# EAGLE design BrainFuino (EAGLE 9.6.0)
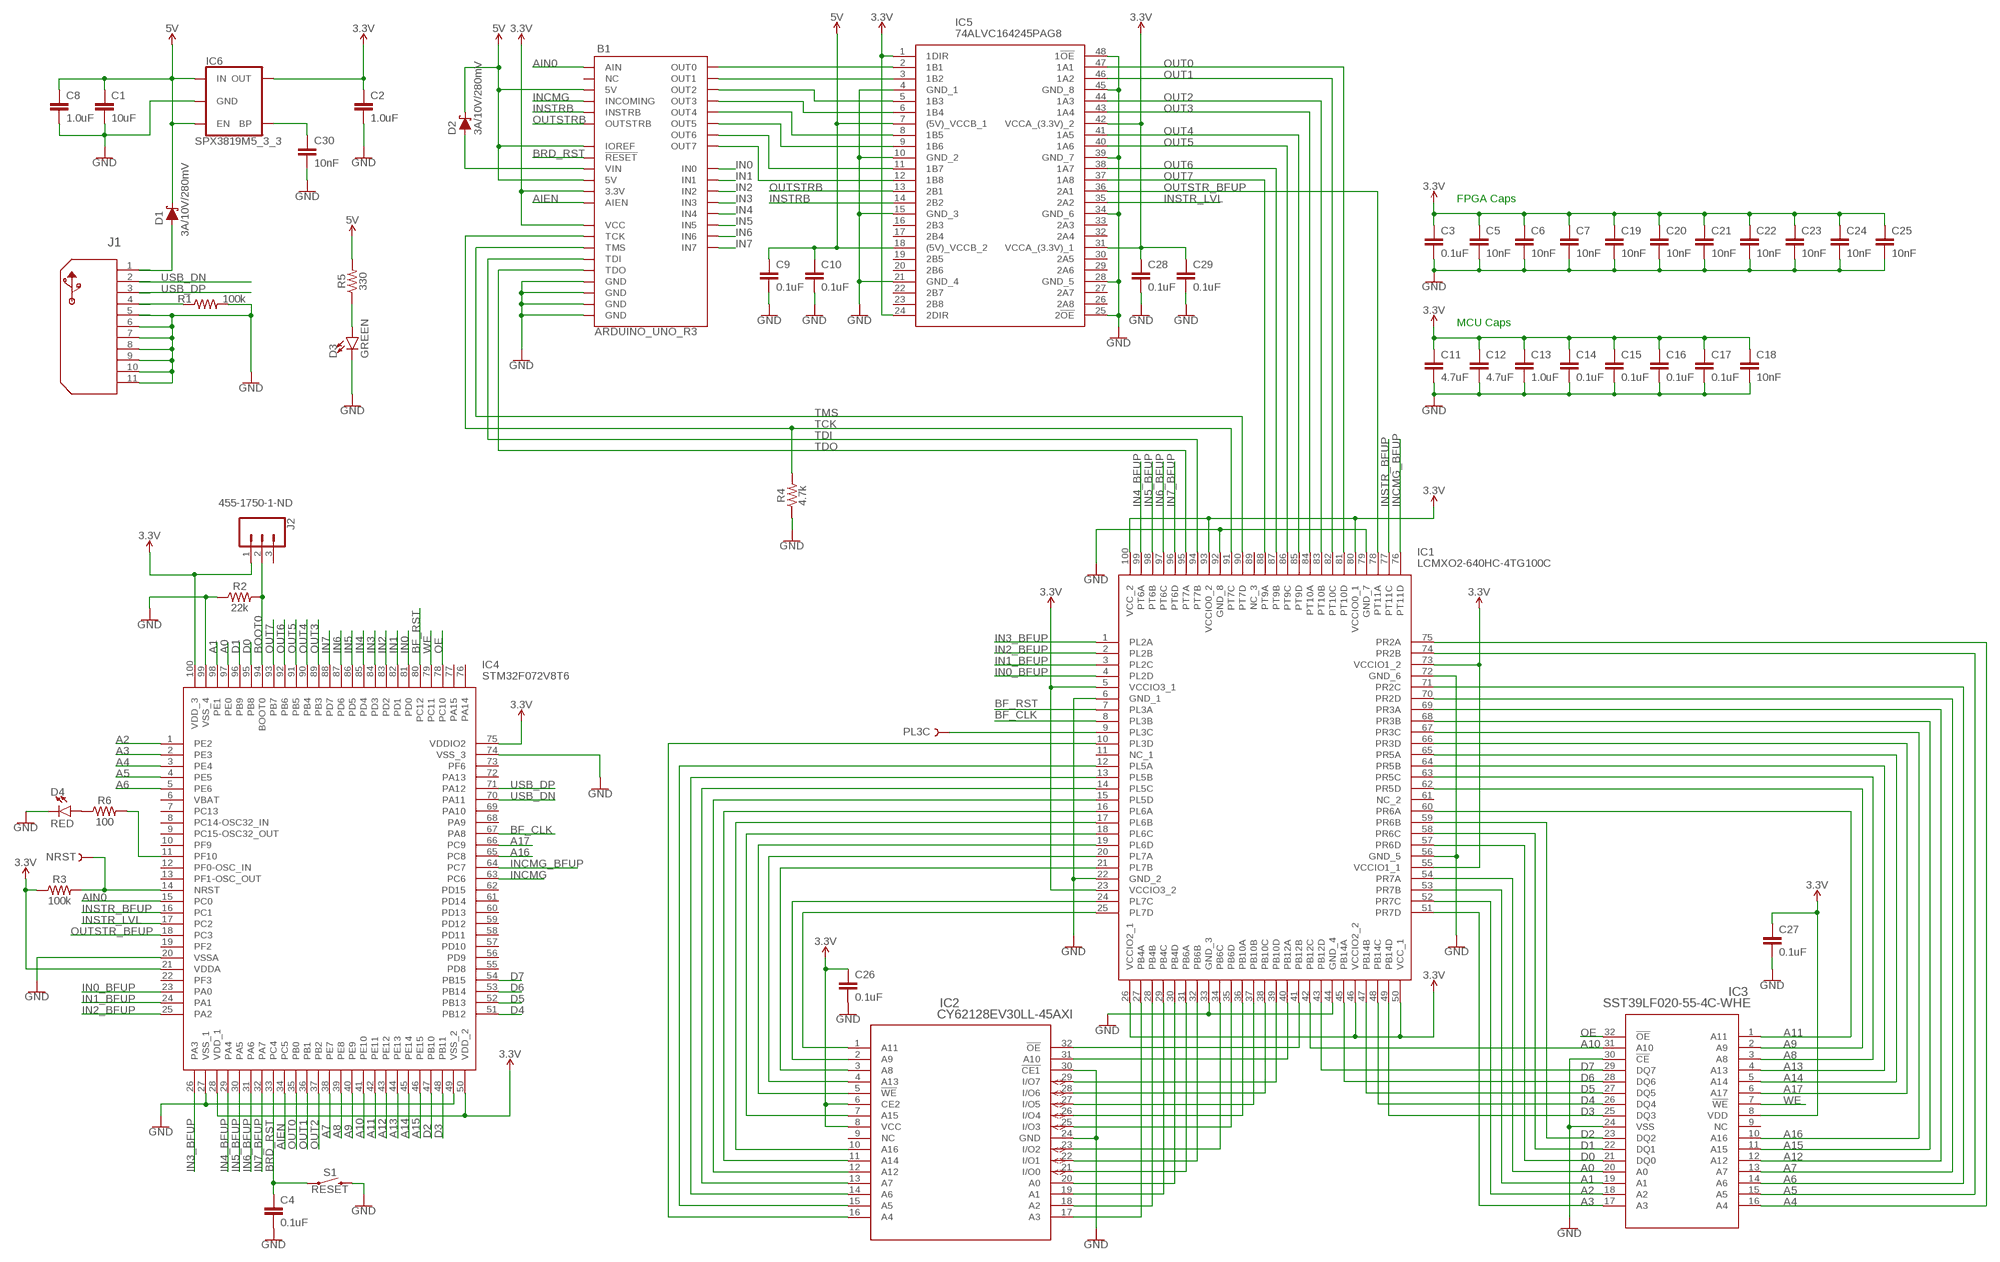
[diagram p0: schematic, sheet 1]

## Parts
B1  ARDUINO_UNO_R3  [ARDUINO_R3]
C1  10uF  10UF-0603-6.3V-20%  [0603]
C2  1.0uF  1.0UF-0603-16V-10%-X7R  [0603]
C3  0.1uF  0.1UF-0603-25V-5%  [0603]
C4  0.1uF  0.1UF-0603-25V-5%  [0603]
C5  10nF  10NF-0603-50V-10%  [0603]
C6  10nF  10NF-0603-50V-10%  [0603]
C7  10nF  10NF-0603-50V-10%  [0603]
C8  1.0uF  1.0UF-0603-16V-10%-X7R  [0603]
C9  0.1uF  0.1UF-0603-25V-5%  [0603]
C10  0.1uF  0.1UF-0603-25V-5%  [0603]
C11  4.7uF  4.7UF-0603-6.3V-(10%)  [0603]
C12  4.7uF  4.7UF-0603-6.3V-(10%)  [0603]
C13  1.0uF  1.0UF-0603-16V-10%  [0603]
C14  0.1uF  0.1UF-0603-25V-5%  [0603]
C15  0.1uF  0.1UF-0603-25V-5%  [0603]
C16  0.1uF  0.1UF-0603-25V-5%  [0603]
C17  0.1uF  0.1UF-0603-25V-5%  [0603]
C18  10nF  10NF-0603-50V-10%  [0603]
C19  10nF  10NF-0603-50V-10%  [0603]
C20  10nF  10NF-0603-50V-10%  [0603]
C21  10nF  10NF-0603-50V-10%  [0603]
C22  10nF  10NF-0603-50V-10%  [0603]
C23  10nF  10NF-0603-50V-10%  [0603]
C24  10nF  10NF-0603-50V-10%  [0603]
C25  10nF  10NF-0603-50V-10%  [0603]
C26  0.1uF  0.1UF-0603-25V-5%  [0603]
C27  0.1uF  0.1UF-0603-25V-5%  [0603]
C28  0.1uF  0.1UF-0603-25V-5%  [0603]
C29  0.1uF  0.1UF-0603-25V-5%  [0603]
C30  10nF  10NF-0603-50V-10%  [0603]
D1  3A/10V/280mV  DIODE-SCHOTTKY-BAT60A  [SOD-323]
D2  3A/10V/280mV  DIODE-SCHOTTKY-BAT60A  [SOD-323]
D3  GREEN  LED-GREEN0603  [LED-0603]
D4  RED  LED-RED0603  [LED-0603]
IC1  LCMXO2-640HC-4TG100C  [QFP50P1600X1600X160-100N]
IC2  CY62128EV30LL-45AXI  [TSOP-32]
IC3  SST39LF020-55-4C-WHE  [TSOP32_WH_SST]
IC4  STM32F072V8T6  [QFP50P1600X1600X160-100N]
IC5  74ALVC164245PAG8  [SOP50P810X120-48N]
IC6  SPX3819M5_3_3  V_REG_SPX3819-SOT23-5  [SOT23-5]
J1  1981568-1  [CONN5_1981568-1_TEC]
J2  455-1750-1-ND  CONN_03  [1X03]
NRST  TEST-POINTPOGO_PTH  [1X01_NO_SILK]
PL3C  TEST-POINTPOGO_PTH  [1X01_NO_SILK]
R1  100k  100KOHM-0603-1/10W-1%  [0603]
R2  22k  22KOHM-0603-1/10W-1%  [0603]
R3  100k  100KOHM-0603-1/10W-1%  [0603]
R4  4.7k  4.7KOHM-0603-1/10W-1%  [0603]
R5  330  330OHM-0603-1/10W-1%  [0603]
R6  100  100OHM-0603-1/10W-1%  [0603]
S1  RESET  MOMENTARY-SWITCH-SPST-SMD-6.2MM-TALL  [TACTILE_SWITCH_SMD_6.2MM_TALL]

## Nets
3.3V: B1.3.3V B1.VCC C2.1 C3.1 C5.1 C6.1 C7.1 C11.1 C12.1 C13.1 C14.1 C15.1 C16.1 C17.1 C18.1 C19.1 C20.1 C21.1 C22.1 C23.1 C24.1 C25.1 C26.1 C27.1 C28.1 C29.1 IC1.5(VCCIO3_1) IC1.23(VCCIO3_2) IC1.26(VCCIO2_1) IC1.46(VCCIO2_2) IC1.50(VCC_1) IC1.55(VCCIO1_1) IC1.73(VCCIO1_2) IC1.80(VCCIO0_1) IC1.93(VCCIO0_2) IC1.100(VCC_2) IC2.6(CE2) IC2.8(VCC) IC3.8(VDD) IC4.21(VDDA) IC4.28(VDD_1) IC4.50(VDD_2) IC4.75(VDDIO2) IC4.100(VDD_3) IC5.1(1DIR) IC5.24(2DIR) IC5.31(VCCA_(3.3V)_1) IC5.42(VCCA_(3.3V)_2) IC6.5(OUT) J2.1 R3.1
5V: B1.5V B1.5V@1(5V) B1.IOREF C1.1 C8.1 C9.1 C10.1 D1.C D2.C IC5.7((5V)_VCCB_1) IC5.18((5V)_VCCB_2) IC6.1(IN) IC6.3(EN) R5.2
A0: IC1.54(PR7A) IC3.20(A0) IC4.97(PE0)
A1: IC1.53(PR7B) IC3.19(A1) IC4.98(PE1)
A2: IC1.52(PR7C) IC3.18(A2) IC4.1(PE2)
A3: IC1.51(PR7D) IC3.17(A3) IC4.2(PE3)
A4: IC1.75(PR2A) IC3.16(A4) IC4.3(PE4)
A5: IC1.74(PR2B) IC3.15(A5) IC4.4(PE5)
A6: IC1.71(PR2C) IC3.14(A6) IC4.5(PE6)
A7: IC1.70(PR2D) IC3.13(A7) IC4.38(PE7)
A8: IC1.63(PR5C) IC3.3(A8) IC4.39(PE8)
A9: IC1.62(PR5D) IC3.2(A9) IC4.40(PE9)
A10: IC1.42(PB12C) IC3.31(A10) IC4.41(PE10)
A11: IC1.60(PR6A) IC3.1(A11) IC4.42(PE11)
A12: IC1.69(PR3A) IC3.12(A12) IC4.43(PE12)
A13: IC1.64(PR5B) IC3.4(A13) IC4.44(PE13)
A14: IC1.65(PR5A) IC3.5(A14) IC4.45(PE14)
A15: IC1.68(PR3B) IC3.11(A15) IC4.46(PE15)
A16: IC1.67(PR3C) IC3.10(A16) IC4.65(PC8)
A17: IC1.66(PR3D) IC3.6(A17) IC4.66(PC9)
AIEN: B1.AREF(AIEN) IC4.34(PC5)
AIN0: B1.AIN IC4.15(PC0)
BF_CLK: IC1.8(PL3B) IC4.67(PA8)
BF_RST: IC1.7(PL3A) IC4.80(PC12)
BOOT0: IC4.94(BOOT0) J2.2 R2.2
BRD_RST: B1.RESET@1(!RESET!) C4.1 IC4.33(PC4) S1.A2
D0: IC1.57(PR6D) IC3.21(DQ0) IC4.95(PB8)
D1: IC1.58(PR6C) IC3.22(DQ1) IC4.96(PB9)
D2: IC1.59(PR6B) IC3.23(DQ2) IC4.47(PB10)
D3: IC1.49(PB14D) IC3.25(DQ3) IC4.48(PB11)
D4: IC1.48(PB14C) IC3.26(DQ4) IC4.51(PB12)
D5: IC1.47(PB14B) IC3.27(DQ5) IC4.52(PB13)
D6: IC1.45(PB14A) IC3.28(DQ6) IC4.53(PB14)
D7: IC1.43(PB12D) IC3.29(DQ7) IC4.54(PB15)
GND: B1.GND@1(GND) B1.GND@2(GND) B1.GND@3(GND) B1.GND@4(GND) C1.2 C2.2 C3.2 C4.2 C5.2 C6.2 C7.2 C8.2 C9.2 C10.2 C11.2 C12.2 C13.2 C14.2 C15.2 C16.2 C17.2 C18.2 C19.2 C20.2 C21.2 C22.2 C23.2 C24.2 C25.2 C26.2 C27.2 C28.2 C29.2 C30.2 D3.C D4.C IC1.6(GND_1) IC1.22(GND_2) IC1.33(GND_3) IC1.44(GND_4) IC1.56(GND_5) IC1.72(GND_6) IC1.79(GND_7) IC1.92(GND_8) IC2.24(GND) IC2.30(!CE1) IC3.24(VSS) IC3.30(!CE) IC4.20(VSSA) IC4.27(VSS_1) IC4.49(VSS_2) IC4.74(VSS_3) IC4.99(VSS_4) IC5.4(GND_1) IC5.10(GND_2) IC5.15(GND_3) IC5.21(GND_4) IC5.25(2!OE) IC5.28(GND_5) IC5.34(GND_6) IC5.39(GND_7) IC5.45(GND_8) IC5.48(1!OE) IC6.2(GND) J1.5 J1.6 J1.7 J1.8 J1.9 J1.10 J1.11 R1.2 R2.1 R4.1 S1.B2
IN0: B1.IN0 IC4.81(PD0)
IN0_BFUP: IC1.4(PL2D) IC4.23(PA0)
IN1: B1.IN1 IC4.82(PD1)
IN1_BFUP: IC1.3(PL2C) IC4.24(PA1)
IN2: B1.IN2 IC4.83(PD2)
IN2_BFUP: IC1.2(PL2B) IC4.25(PA2)
IN3: B1.IN3 IC4.84(PD3)
IN3_BFUP: IC1.1(PL2A) IC4.26(PA3)
IN4: B1.IN4 IC4.85(PD4)
IN4_BFUP: IC1.99(PT6A) IC4.29(PA4)
IN5: B1.IN5 IC4.86(PD5)
IN5_BFUP: IC1.98(PT6B) IC4.30(PA5)
IN6: B1.IN6 IC4.87(PD6)
IN6_BFUP: IC1.97(PT6C) IC4.31(PA6)
IN7: B1.IN7 IC4.88(PD7)
IN7_BFUP: IC1.96(PT6D) IC4.32(PA7)
INCMG: B1.INCOMING IC4.63(PC6)
INCMG_BFUP: IC1.76(PT11D) IC4.64(PC7)
INSTR_BFUP: IC1.77(PT11C) IC4.16(PC1)
INSTR_LVL: IC4.17(PC2) IC5.35(2A2)
INSTRB: B1.INST(INSTRB) IC5.14(2B2)
N$1: IC1.28(PB4B) IC2.18(A2)
N$2: IC1.29(PB4C) IC2.19(A1)
N$3: IC1.30(PB4D) IC2.20(A0)
N$4: IC1.31(PB6A) IC2.21(I/O0)
N$5: IC1.32(PB6B) IC2.22(I/O1)
N$6: IC1.34(PB6C) IC2.23(I/O2)
N$7: IC1.35(PB6D) IC2.25(I/O3)
N$8: IC1.41(PB12B) IC2.32(!OE)
N$9: IC1.27(PB4A) IC2.17(A3)
N$10: IC1.36(PB10A) IC2.26(I/O4)
N$11: IC1.37(PB10B) IC2.27(I/O5)
N$12: IC1.38(PB10C) IC2.28(I/O6)
N$13: IC1.39(PB10D) IC2.29(I/O7)
N$14: IC1.40(PB12A) IC2.31(A10)
N$15: IC1.9(PL3C) PL3C.1
N$16: D3.A R5.1
N$17: C30.1 IC6.4(BP)
N$18: B1.VIN D2.A
N$19: D1.A J1.1
N$20: IC4.11(PF10) R6.2
N$21: D4.A R6.1
N$23: IC4.14(NRST) NRST.1 R3.2
N$34: B1.OUT0 IC5.2(1B1)
N$35: IC1.25(PL7D) IC2.1(A11)
N$36: IC1.24(PL7C) IC2.2(A9)
N$37: IC1.21(PL7B) IC2.3(A8)
N$40: IC1.18(PL6C) IC2.7(A15)
N$43: IC1.15(PL5D) IC2.12(A12)
N$44: IC1.14(PL5C) IC2.13(A7)
N$45: IC1.13(PL5B) IC2.14(A6)
N$46: IC1.12(PL5A) IC2.15(A5)
N$47: IC1.10(PL3D) IC2.16(A4)
N$49: B1.OUT1 IC5.3(1B2)
N$50: B1.OUT2 IC5.5(1B3)
N$51: B1.OUT3 IC5.6(1B4)
N$52: B1.OUT4 IC5.8(1B5)
N$53: B1.OUT5 IC5.9(1B6)
N$54: IC1.17(PL6B) IC2.10(A16)
N$55: B1.OUT6 IC5.11(1B7)
N$56: B1.OUT7 IC5.12(1B8)
N$58: IC1.20(PL7A) IC2.4(A13)
N$59: IC1.19(PL6D) IC2.5(!WE)
N$61: IC1.16(PL6A) IC2.11(A14)
N$93: J1.4 R1.1
OE: IC3.32(!OE) IC4.78(PC10)
OUT0: IC1.81(PT10D) IC4.35(PB0) IC5.47(1A1)
OUT1: IC1.82(PT10C) IC4.36(PB1) IC5.46(1A2)
OUT2: IC1.83(PT10B) IC4.37(PB2) IC5.44(1A3)
OUT3: IC1.84(PT10A) IC4.89(PB3) IC5.43(1A4)
OUT4: IC1.85(PT9D) IC4.90(PB4) IC5.41(1A5)
OUT5: IC1.86(PT9C) IC4.91(PB5) IC5.40(1A6)
OUT6: IC1.87(PT9B) IC4.92(PB6) IC5.38(1A7)
OUT7: IC1.88(PT9A) IC4.93(PB7) IC5.37(1A8)
OUTSTR_BFUP: IC1.78(PT11A) IC4.18(PC3) IC5.36(2A1)
OUTSTRB: B1.OUTST(OUTSTRB) IC5.13(2B1)
TCK: B1.TCK IC1.91(PT7C) R4.2
TDI: B1.TDI IC1.94(PT7B)
TDO: B1.TDO IC1.95(PT7A)
TMS: B1.TMS IC1.90(PT7D)
USB_DN: IC4.70(PA11) J1.2
USB_DP: IC4.71(PA12) J1.3
WE: IC3.7(!WE) IC4.79(PC11)
Unconnected: B1.NC@1(NC) IC1.11(NC_1) IC1.61(NC_2) IC1.89(NC_3) IC2.9(NC) IC3.9(NC) IC4.6(VBAT) IC4.7(PC13) IC4.8(PC14-OSC32_IN) IC4.9(PC15-OSC32_OUT) IC4.10(PF9) IC4.12(PF0-OSC_IN) IC4.13(PF1-OSC_OUT) IC4.19(PF2) IC4.22(PF3) IC4.55(PD8) IC4.56(PD9) IC4.57(PD10) IC4.58(PD11) IC4.59(PD12) IC4.60(PD13) IC4.61(PD14) IC4.62(PD15) IC4.68(PA9) IC4.69(PA10) IC4.72(PA13) IC4.73(PF6) IC4.76(PA14) IC4.77(PA15) IC5.16(2B3) IC5.17(2B4) IC5.19(2B5) IC5.20(2B6) IC5.22(2B7) IC5.23(2B8) IC5.26(2A8) IC5.27(2A7) IC5.29(2A6) IC5.30(2A5) IC5.32(2A4) IC5.33(2A3) J2.3

## Notes on the sheet
- FPGA Caps
- MCU Caps

## Library data of the parts
B1 = BFuP:ARDUINO_UNO_R3: Arduino R3 Footprint with SPI header Arduino Uno R3 Compatible Footprint. Matches PCB size of the original board. SparkFun Products: SAMD21 Dev Breakout <https://www.sparkfun.com/products/13672> RedBoard <https://www.sparkfun.com/products/12757> R3 Stackable Headers <https://www.sparkfun.com/products/11417>
C1 = SparkFun-Capacitors:10UF: 10.0µF ceramic capacitors A capacitor is a passive two-terminal electrical component used to store electrical energy temporarily in an electric field.; PROD_ID: CAP-11015
C2 C8 = SparkFun-Capacitors:1.0UF: 1µF ceramic capacitors A capacitor is a passive two-terminal electrical component used to store electrical energy temporarily in an electric field.; PROD_ID: CAP-13930
C3 C4 C9 C10 C14-C17 C26-C29 = SparkFun-Capacitors:0.1UF: 0.1µF ceramic capacitors A capacitor is a passive two-terminal electrical component used to store electrical energy temporarily in an electric field.; PROD_ID: CAP-08604
C5-C7 C18-C25 C30 = SparkFun-Capacitors:10NF: 0.01uF/10nF/10,000pF ceramic capacitors A capacitor is a passive two-terminal electrical component used to store electrical energy temporarily in an electric field. CAP-09321; PROD_ID: CAP-00867
C11 C12 = SparkFun-Capacitors:4.7UF: 4.7µF ceramic capacitors A capacitor is a passive two-terminal electrical component used to store electrical energy temporarily in an electric field.; PROD_ID: CAP-08280
C13 = SparkFun-Capacitors:1.0UF: 1µF ceramic capacitors A capacitor is a passive two-terminal electrical component used to store electrical energy temporarily in an electric field.; PROD_ID: CAP-00868
D1 D2 = SparkFun-DiscreteSemi:DIODE-SCHOTTKY: Schottky diode A Schottky diode is a semiconductor diode which has a low forward voltage drop and a very fast switching action.; PROD_ID: DIO-14072
D3 = SparkFun-LED:LED-GREEN: Green SMD LED Used in manufacturing of various products at SparkFun Packages: 0603 - SMD 0603 package [Product Link] <http://www.futureelectronics.com/en/technologies/semiconductors/optoelectronics/leds/Pages/9894312-LTST-C190GKT.aspx?CrossPart=HSMG-C190&IM=0> LilyPad 1206 - SMD1206 LilyPad package [Product Link] <http://www.futureelectronics.com/en/Technologies/Product.aspx?ProductID=IN150NGHARVATEKCORPORATION2049943&IM=0> 1206 - SMD1206 package [Product Link] <http://www.futureelectronics.com/en/technologies/semiconductors/optoelectronics/leds/Pages/8315665-LTST-C150KGKT.aspx?IM=0> 1206 Bottom Mount -SMD 1206 Bottom Mount [Product Link] <http://www.digikey.com/product-detail/en/lite-on-inc/LTST-C230KGKT/160-1456-1-ND/386854> SparkFun Products: Pro Mini 328 -5V <https://www.sparkfun.com/products/821> RedBoard <https://www.sparkfun.com/products/12757> MP3 Trigger <https://www.sparkfun.com/products/13720> Makey Makey <https://www.sparkfun.com/products/11076>; PROD_ID: DIO-00821
D4 = SparkFun-LED:LED-RED: Red SMD LED Used in manufacturing of most products at SparkFun Packages: 0603 - SMD 0603 package [Product Link] <http://docs.avagotech.com/docs/AV02-0551EN> 0603 SMART - SMD 0603 SMART package ( more efficient and expensive)[Product Link] <http://www.osram-os.com/Graphics/XPic2/00077099_0.pdf> 1206 - SMD1206 package [Product Link] <https://www.sparkfun.com/datasheets/DevTools/LilyPad/Q150OVS4.pdff> SparkFun Products: Pro Mini 328 -5V <https://www.sparkfun.com/products/821> RedBoard <https://www.sparkfun.com/products/12757> IOIO-OTG <https://www.sparkfun.com/products/13613>; PROD_ID: DIO-00819
IC1 = BFuP:LCMXO2-640HC-4TG100C: FPGA - Field Programmable Gate Array 640 LUTs 79 IO 3.3V 4 Spd Source: Datasheet <https://componentsearchengine.com/Datasheets/1/LCMXO2-640HC-4TG100C.pdf>; DESCRIPTION: FPGA - Field Programmable Gate Array 640 LUTs 79 IO 3.3V 4 Spd; HEIGHT: 1.6mm; MANUFACTURER_NAME: Lattice Semiconductor; MANUFACTURER_PART_NUMBER: LCMXO2-640HC-4TG100C; MOUSER_PART_NUMBER: 842-XO2640HC4TG100C; MOUSER_PRICE-STOCK: https://www.mouser.com/Search/Refine.aspx?Keyword=842-XO2640HC4TG100C
IC2 = BFuP:CY62128EV30LL-45AXI; BUILT_BY: EMA_UL_Team; MANUFACTURER_PART_NUMBER: CY62128EV30LL-45AXI; VENDOR: Cypress Semiconductor
IC3 = BFuP:SST39LF020-55-4C-WHE; BUILT_BY: EMA_Jessica; COPYRIGHT: Copyright (C) 2018 Accelerated Designs. All rights reserved; MANUFACTURER_PART_NUMBER: SST39LF020-55-4C-WHE; VENDOR: Microchip
IC4 = BFuP:STM32F072V8T6: ARM Microcontrollers - MCU 16/32-BITS MICROS Source: Datasheet <https://componentsearchengine.com/Datasheets/1/STM32F072V8T6.pdf>; DESCRIPTION: ARM Microcontrollers - MCU 16/32-BITS MICROS; HEIGHT: 1.6mm; MANUFACTURER_NAME: STMicroelectronics; MANUFACTURER_PART_NUMBER: STM32F072V8T6; MOUSER_PART_NUMBER: 511-STM32F072V8T6; MOUSER_PRICE-STOCK: https://www.mouser.com/Search/Refine.aspx?Keyword=511-STM32F072V8T6
IC5 = BFuP:74ALVC164245PAG8: Bus Transceivers 16-bit 3.3V-to-5V Transceiver Source: Datasheet <https://componentsearchengine.com/Datasheets/1/74ALVC164245PAG8.pdf>; DESCRIPTION: Bus Transceivers 16-bit 3.3V-to-5V Transceiver; HEIGHT: 1.2mm; MANUFACTURER_NAME: IDT; MANUFACTURER_PART_NUMBER: 74ALVC164245PAG8; MOUSER_PART_NUMBER: 972-74ALVC164245PAG8; MOUSER_PRICE-STOCK: https://www.mouser.com/Search/Refine.aspx?Keyword=972-74ALVC164245PAG8
IC6 = SparkFun-IC-Power:V_REG_SPX3819: SPX3819 Voltage Regulator 3.3V 500mA, 16V input Datasheet <https://www.exar.com/content/document.ashx?id=22106> SparkFun Products: SparkFun Serial Controlled Motor Driver <https://www.sparkfun.com/products/13911>; PROD_ID: VREG-13321
J1 = BFuP:1981568-1; BUILT_BY: EMA_UL_Team; CENTERLINE__PITCH_: 0.025; CONFIGURATION: 1; CONNECTOR_TYPE: USB; COPYRIGHT: Copyright (C) 2016 Accelerated Designs. All rights reserved; DESCRIPTION: REC TYPE B ASSY (Au) MICRO USB; MANUFACTURER_PART_NUMBER: 1981568-1; NUMBER_OF_POSITIONS: 5; PITCH_MM_: 0.025; POSITIONS: 5; PRODUCT: Connector; ROWS-CONFIG: 1; SOURCELIBRARY: TE_Connectivity-2018-03-16; TE_INTERNAL_NUMBER: 1981568-1; TE_PART_NUMBER: 1981568-1; TYPE: USB 2.0; VENDOR: TE Connectivity
J2 = SparkFun-Connectors:CONN_03: Multi connection point. Often used as Generic Header-pin footprint for 0.1 inch spaced/style header connections On any of the 0.1 inch spaced packages, you can populate with these: Break Away Headers - Straight <https://www.sparkfun.com/products/116> (PRT-00116) Break Away Male Headers - Right Angle <https://www.sparkfun.com/products/553> (PRT-00553) Female Headers <https://www.sparkfun.com/products/115> (PRT-00115) Break Away Headers - Machine Pin <https://www.sparkfun.com/products/117> (PRT-00117) Break Away Female Headers - Swiss Machine Pin <https://www.sparkfun.com/products/743> (PRT-00743) Stackable Header - 3 Pin (Female, 0.1") <https://www.sparkfun.com/products/13875> (PRT-13875) For SCREWTERMINALS and SPRING TERMINALS visit here: Screw Terimnals on SparkFun.com <https://www.sparkfun.com/search/results?term=Screw+Terminals> (5mm/3.5mm/2.54mm spacing) This device is also useful as a general connection point to wire up your design to another part of your project. Our various solder wires solder well into these plated through hole pads. Hook-Up Wire - Assortment (Stranded, 22 AWG) <https://www.sparkfun.com/products/11375> (PRT-11375) Hook-Up Wire - Assortment (Solid Core, 22 AWG) <https://www.sparkfun.com/products/11367> (PRT-11367) View the entire wire category on our website here <https://www.sparkfun.com/categories/141> Special notes: Molex polarized connector foot print use with SKU : PRT-08232 with associated crimp pins and housings.; PROD_ID: XXX-00000
NRST PL3C = SparkFun-Connectors:TEST-POINT: SparkFun Test Points Bare copper test points for troubleshooting or In-Circuit-Testing. These are used by our Production team for verifying production board runs using pogo-pins on test beds. SparkFun Products: SparkFun LSM9DS1 Breakout <https://www.sparkfun.com/products/13284> SparkFun PSOC <https://www.sparkfun.com/products/13714> SparkFun Load Cell Amplifier <https://www.sparkfun.com/products/13879>
R1 R3 = SparkFun-Resistors:100KOHM: 100kΩ resistor A resistor is a passive two-terminal electrical component that implements electrical resistance as a circuit element. Resistors act to reduce current flow, and, at the same time, act to lower voltage levels within circuits. - Wikipedia; PROD_ID: RES-07828
R2 = SparkFun-Resistors:22KOHM: 22kΩ resistor A resistor is a passive two-terminal electrical component that implements electrical resistance as a circuit element. Resistors act to reduce current flow, and, at the same time, act to lower voltage levels within circuits. - Wikipedia; PROD_ID: RES-07853
R4 = SparkFun-Resistors:4.7KOHM: 4.7kΩ resistor A resistor is a passive two-terminal electrical component that implements electrical resistance as a circuit element. Resistors act to reduce current flow, and, at the same time, act to lower voltage levels within circuits. - Wikipedia; PROD_ID: RES-07857
R5 = SparkFun-Resistors:330OHM: 330Ω resistor A resistor is a passive two-terminal electrical component that implements electrical resistance as a circuit element. Resistors act to reduce current flow, and, at the same time, act to lower voltage levels within circuits. - Wikipedia; PROD_ID: RES-00818
R6 = SparkFun-Resistors:100OHM: 100Ω resistor A resistor is a passive two-terminal electrical component that implements electrical resistance as a circuit element. Resistors act to reduce current flow, and, at the same time, act to lower voltage levels within circuits. - Wikipedia; PROD_ID: RES-07863
S1 = SparkFun-Switches:MOMENTARY-SWITCH-SPST: Momentary Switch (Pushbutton) - SPST Normally-open (NO) SPST momentary switches (buttons, pushbuttons). Variants PTH-12MM - 12mm square, through-hole Momentary Pushbutton Switch - 12mm Square <https://www.sparkfun.com/products/9190> (COM-09190) PTH-6.0MM, PTH-6.0MM-KIT - 6.0mm square, through-hole Mini Pushbutton Switch <https://www.sparkfun.com/products/97> (COM-00097) KIT package intended for soldering kit's - only one side of pads' copper is exposed. PTH-RIGHT-ANGLE-KIT - Right-angle, through-hole Right Angle Tactile Button <https://www.sparkfun.com/products/10791> - Used on SparkFun BigTime Watch Kit <https://www.sparkfun.com/products/11734> SMD-12MM - 12mm square, surface-mount Tactile Button - SMD (12mm) <https://www.sparkfun.com/products/12993> (COM-12993) Used on SparkFun PicoBoard <https://www.sparkfun.com/products/11888> SMD-4.5MM - 4.5mm Square Trackball Switch Used on SparkFun Blackberry Trackballer Breakout <https://www.sparkfun.com/products/13169> SMD-4.6MMX2.8MM - 4.60mm x 2.80mm, surface mount Used on SparkFun SAMD21 Mini Breakout <https://www.sparkfun.com/products/13664> SMD-5.2MM, SMD-5.2-REDUNDANT - 5.2mm square, surface-mount Mini Pushbutton Switch - SMD <https://www.sparkfun.com/products/8720> (COM-08720) Used on Arduino Pro Mini <https://www.sparkfun.com/products/11114> REDUNDANT package connects both switch circuits together SMD-6.0X3.5MM - 6.0 x 3.5mm, surface mount Momentary Reset Switch SMD <https://www.sparkfun.com/products/8229> (COM-08229) SMD-6.2MM-TALL - 6.2mm square, surface mount Tactile Button - SMD (6mm) <https://www.sparkfun.com/products/12992> Used on SparkFun Digital Sandbox <https://www.sparkfun.com/products/12651> SMD-RIGHT-ANGLE - Right-angle, surface mount Used on SparkFun Block for Intel® Edison - Arduino <https://www.sparkfun.com/products/13036>; PROD_ID: SWCH-11966; SF_SKU: COM-12992

## Board
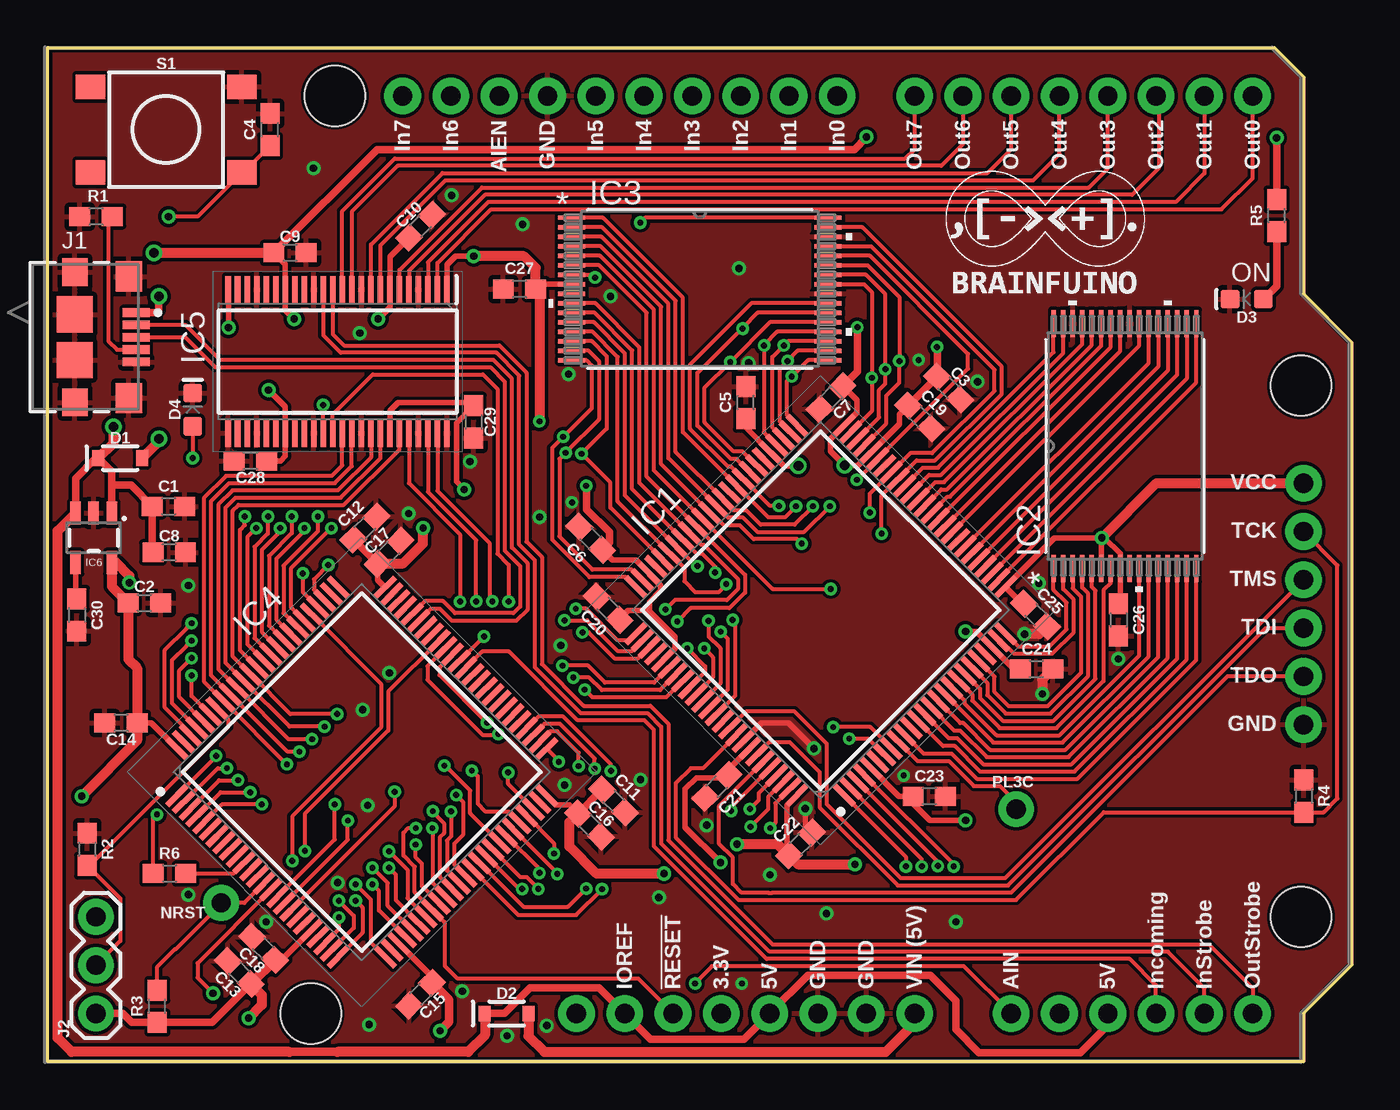
[diagram p1: board, top side]
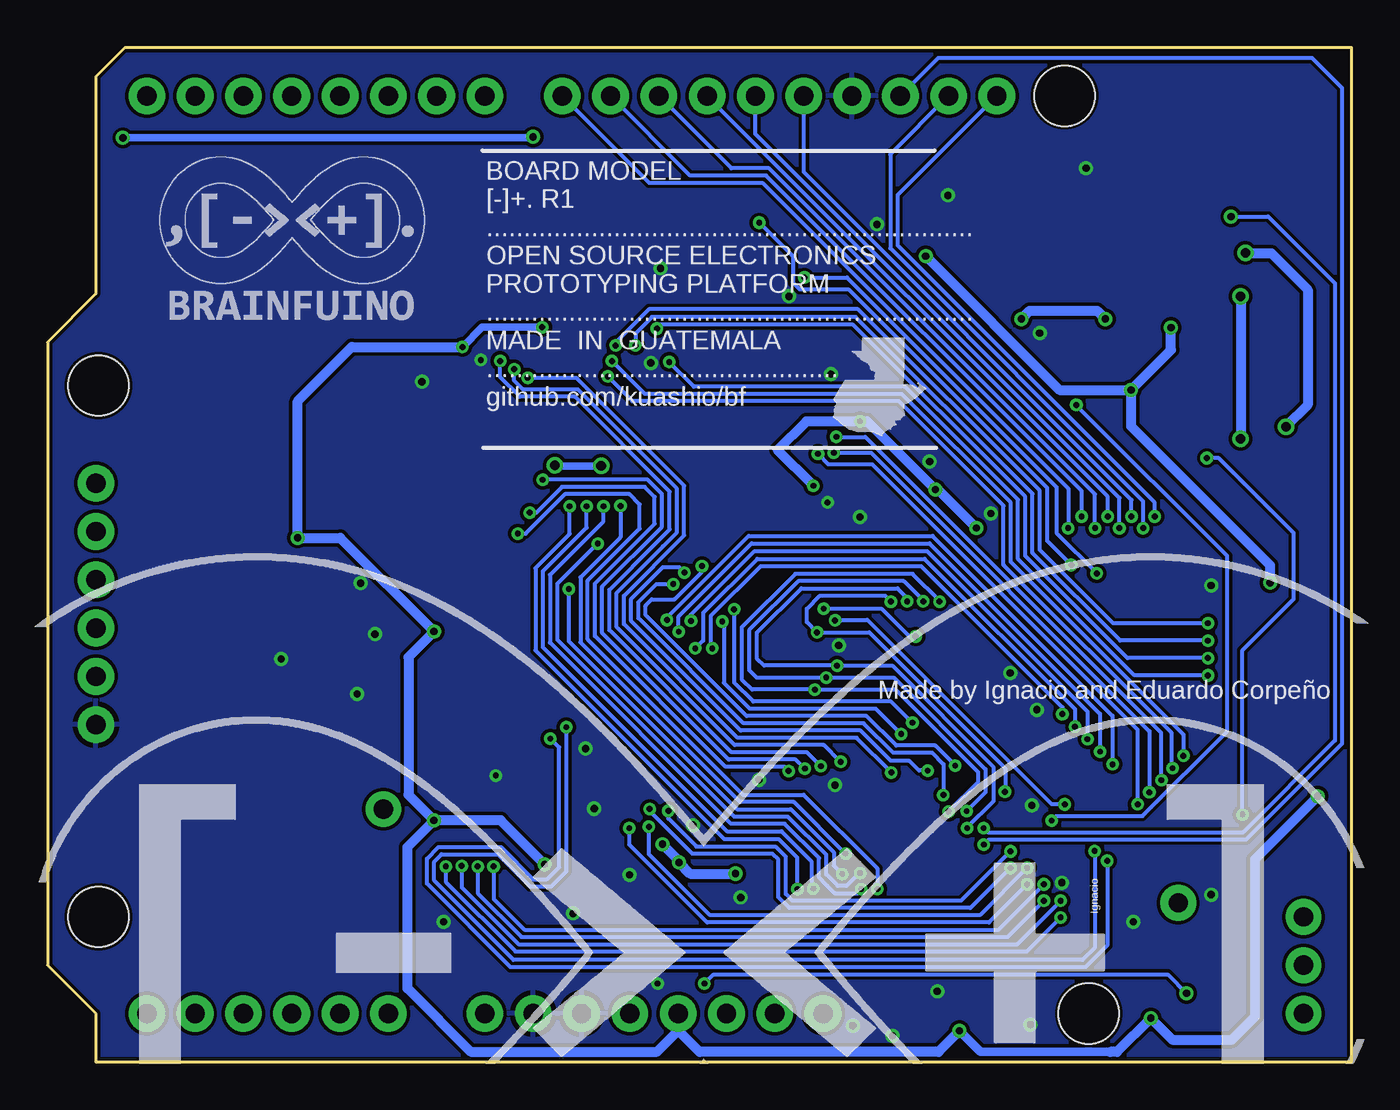
[diagram p2: board, bottom side, seen from below]

Size 68.58 x 53.34 mm. Coordinates in mm from the lower left corner, seen from the top.
Outline: 0,0 0,53.34 64.52,53.34 66.04,51.82 66.04,40.39 68.58,37.85 68.58,5.08 66.04,2.54 66.04,0 0,0
Copper layers (1*16): Top 0.035mm / dielectric 1.5mm / Bottom 0.035mm
Design rules "SparkFun-2-layer-TIGHT *": minimum track width 7mil, minimum drill 12mil, track to track 7mil, track to pad 7mil, pad to pad 7mil, via to via 7mil, smd to smd 7mil, copper to edge 7mil, drill to drill 7mil, minimum pad ring 7mil, minimum via ring 7mil, stop-mask expansion 4mil, vias tented up to drill 25mil, thermal gap 10mil

### Footprints (pad centres in the part's own frame; a part is rotated, then mirrored left to right if it is on the bottom)
ARDUINO_R3 = drill 1.016 pad 1.93: 3.3V 2.54,-24.13; 5V 5.08,-24.13; 5V@1 22.86,-24.13; AIN 17.78,-24.13; AREF -9.144,24.13; GND@1 7.62,-24.13; GND@2 10.16,-24.13; GND@3 -6.604,24.13; GND@4 33.16,-8.94; IN0 8.636,24.13; IN1 6.096,24.13; IN2 3.556,24.13; IN3 1.016,24.13; IN4 -1.524,24.13; IN5 -4.064,24.13; IN6 -11.684,24.13; IN7 -14.224,24.13; INCOMING 25.4,-24.13; INST 27.94,-24.13; IOREF -2.54,-24.13; NC -5.08,-24.13; NC@1 20.32,-24.13; OUT0 30.48,24.13; OUT1 27.94,24.13; OUT2 25.4,24.13; OUT3 22.86,24.13; OUT4 20.32,24.13; OUT5 17.78,24.13; OUT6 15.24,24.13; OUT7 12.7,24.13; OUTST 30.48,-24.13; RESET@1 0,-24.13; TCK 33.16,1.22; TDI 33.16,-3.86; TDO 33.16,-6.4; TMS 33.16,-1.32; VCC 33.16,3.76; VIN 12.7,-24.13 | hole 3.175: -17.78,24.13; 33.02,8.89; 33.02,-19.05; -19.05,-24.13
0603 = smd 1.1 x 1: 1 -0.85,0; 2 0.85,0
SOD-323 = smd 0.63 x 0.83: A 1.15,0; C -1.15,0
LED-0603 = smd 1 x 1: A -0.877,0; C 0.877,0
QFP50P1600X1600X160-100N = smd 1.475 x 0.3: 1 -7.738,6; 2 -7.738,5.5; 3 -7.738,5; 4 -7.738,4.5; 5 -7.738,4; 6 -7.738,3.5; 7 -7.738,3; 8 -7.738,2.5; 9 -7.738,2; 10 -7.738,1.5; 11 -7.738,1; 12 -7.738,0.5; 13 -7.738,0; 14 -7.738,-0.5; 15 -7.738,-1; 16 -7.738,-1.5; 17 -7.738,-2; 18 -7.738,-2.5; 19 -7.738,-3; 20 -7.738,-3.5; 21 -7.738,-4; 22 -7.738,-4.5; 23 -7.738,-5; 24 -7.738,-5.5; 25 -7.738,-6; 51 7.738,-6; 52 7.738,-5.5; 53 7.738,-5; 54 7.738,-4.5; 55 7.738,-4; 56 7.738,-3.5; 57 7.738,-3; 58 7.738,-2.5; 59 7.738,-2; 60 7.738,-1.5; 61 7.738,-1; 62 7.738,-0.5; 63 7.738,0; 64 7.738,0.5; 65 7.738,1; 66 7.738,1.5; 67 7.738,2; 68 7.738,2.5; 69 7.738,3; 70 7.738,3.5; 71 7.738,4; 72 7.738,4.5; 73 7.738,5; 74 7.738,5.5; 75 7.738,6 | smd 0.3 x 1.475: 26 -6,-7.738; 27 -5.5,-7.738; 28 -5,-7.738; 29 -4.5,-7.738; 30 -4,-7.738; 31 -3.5,-7.738; 32 -3,-7.738; 33 -2.5,-7.738; 34 -2,-7.738; 35 -1.5,-7.738; 36 -1,-7.738; 37 -0.5,-7.738; 38 0,-7.738; 39 0.5,-7.738; 40 1,-7.738; 41 1.5,-7.738; 42 2,-7.738; 43 2.5,-7.738; 44 3,-7.738; 45 3.5,-7.738; 46 4,-7.738; 47 4.5,-7.738; 48 5,-7.738; 49 5.5,-7.738; 50 6,-7.738; 76 6,7.738; 77 5.5,7.738; 78 5,7.738; 79 4.5,7.738; 80 4,7.738; 81 3.5,7.738; 82 3,7.738; 83 2.5,7.738; 84 2,7.738; 85 1.5,7.738; 86 1,7.738; 87 0.5,7.738; 88 0,7.738; 89 -0.5,7.738; 90 -1,7.738; 91 -1.5,7.738; 92 -2,7.738; 93 -2.5,7.738; 94 -3,7.738; 95 -3.5,7.738; 96 -4,7.738; 97 -4.5,7.738; 98 -5,7.738; 99 -5.5,7.738; 100 -6,7.738
TSOP-32 = smd 1.422 x 0.229: 1 -6.439,3.75; 2 -6.439,3.25; 3 -6.439,2.75; 4 -6.439,2.25; 5 -6.439,1.75; 6 -6.439,1.25; 7 -6.439,0.75; 8 -6.439,0.25; 9 -6.439,-0.25; 10 -6.439,-0.75; 11 -6.439,-1.25; 12 -6.439,-1.75; 13 -6.439,-2.25; 14 -6.439,-2.75; 15 -6.439,-3.25; 16 -6.439,-3.75; 17 6.439,-3.75; 18 6.439,-3.25; 19 6.439,-2.75; 20 6.439,-2.25; 21 6.439,-1.75; 22 6.439,-1.25; 23 6.439,-0.75; 24 6.439,-0.25; 25 6.439,0.25; 26 6.439,0.75; 27 6.439,1.25; 28 6.439,1.75; 29 6.439,2.25; 30 6.439,2.75; 31 6.439,3.25; 32 6.439,3.75
TSOP32_WH_SST = smd 1.422 x 0.229: 1 -6.744,3.75; 2 -6.744,3.25; 3 -6.744,2.75; 4 -6.744,2.25; 5 -6.744,1.75; 6 -6.744,1.25; 7 -6.744,0.75; 8 -6.744,0.25; 9 -6.744,-0.25; 10 -6.744,-0.75; 11 -6.744,-1.25; 12 -6.744,-1.75; 13 -6.744,-2.25; 14 -6.744,-2.75; 15 -6.744,-3.25; 16 -6.744,-3.75; 17 6.744,-3.75; 18 6.744,-3.25; 19 6.744,-2.75; 20 6.744,-2.25; 21 6.744,-1.75; 22 6.744,-1.25; 23 6.744,-0.75; 24 6.744,-0.25; 25 6.744,0.25; 26 6.744,0.75; 27 6.744,1.25; 28 6.744,1.75; 29 6.744,2.25; 30 6.744,2.75; 31 6.744,3.25; 32 6.744,3.75
SOP50P810X120-48N = smd 1.45 x 0.3: 1 -3.775,5.75; 2 -3.775,5.25; 3 -3.775,4.75; 4 -3.775,4.25; 5 -3.775,3.75; 6 -3.775,3.25; 7 -3.775,2.75; 8 -3.775,2.25; 9 -3.775,1.75; 10 -3.775,1.25; 11 -3.775,0.75; 12 -3.775,0.25; 13 -3.775,-0.25; 14 -3.775,-0.75; 15 -3.775,-1.25; 16 -3.775,-1.75; 17 -3.775,-2.25; 18 -3.775,-2.75; 19 -3.775,-3.25; 20 -3.775,-3.75; 21 -3.775,-4.25; 22 -3.775,-4.75; 23 -3.775,-5.25; 24 -3.775,-5.75; 25 3.775,-5.75; 26 3.775,-5.25; 27 3.775,-4.75; 28 3.775,-4.25; 29 3.775,-3.75; 30 3.775,-3.25; 31 3.775,-2.75; 32 3.775,-2.25; 33 3.775,-1.75; 34 3.775,-1.25; 35 3.775,-0.75; 36 3.775,-0.25; 37 3.775,0.25; 38 3.775,0.75; 39 3.775,1.25; 40 3.775,1.75; 41 3.775,2.25; 42 3.775,2.75; 43 3.775,3.25; 44 3.775,3.75; 45 3.775,4.25; 46 3.775,4.75; 47 3.775,5.25; 48 3.775,5.75
SOT23-5 = smd 0.55 x 1.2: 1 -0.95,-1.3; 2 0,-1.3; 3 0.95,-1.3; 4 0.95,1.3; 5 -0.95,1.3
CONN5_1981568-1_TEC = smd 0.457 x 1.397: 1 -1.33,2.286; 2 -0.68,2.286; 3 -0.03,2.286; 4 0.62,2.286; 5 1.27,2.286 | smd 1.6 x 1.397: 6 -3.23,1.905; 7 3.17,1.905 | smd 1.448 x 1.346: 8 -3.455,-0.94; 9 3.395,-0.94 | smd 1.905 x 1.905: 10 -1.23,-0.94; 11 1.17,-0.94
1X03 = drill 1.016 pad 1.88: 1 0,0; 2 2.54,0; 3 5.08,0
1X01_NO_SILK = drill 1.016 pad 1.88: 1 0,0
TACTILE_SWITCH_SMD_6.2MM_TALL = smd 1.55 x 1.3: A1 -3.975,-2.25; A2 3.975,-2.25; B1 -3.975,2.25; B2 3.975,2.25

### Placement (x,y rotation side)
B1  32.88,26.67 0 top
C1  6.35,29.21 0 top
C2  5.08,24.13 0 top
C3  47.37,35.43 315 top
C4  11.68,49.02 90 top
C5  36.7,34.67 90 top
C6  28.55,27.53 135 top
C7  41.19,34.92 225 top
C8  6.39,26.8 0 top
C9  12.74,42.55 0 top
C10  19.6,43.94 45 top
C11  29.76,13.72 315 top
C12  16.68,28.07 45 top
C13  10.07,4.7 135 top
C14  3.85,17.83 180 top
C15  19.6,3.56 225 top
C16  28.49,12.45 315 top
C17  17.95,26.8 45 top
C18  11.34,5.97 135 top
C19  45.85,33.91 315 top
C20  29.46,23.85 135 top
C21  35.18,14.48 225 top
C22  39.57,11.46 45 top
C23  46.35,13.97 0 top
C24  51.99,20.65 0 top
C25  51.94,23.5 315 top
C26  56.3,23.24 270 top
C27  24.8,40.64 180 top
C28  10.66,31.6 180 top
C29  22.39,33.66 270 top
C30  1.52,23.5 270 top
D1  3.81,31.75 0 top
D2  24.13,2.54 0 top
D3  63.04,40.11 180 top
D4  7.62,34.29 90 top
IC1  40.64,23.75 135 top
IC2  56.64,32.38 90 top
IC3  34.29,40.64 0 top
IC4  16.51,15.24 45 top
IC5  15.24,36.83 270 top
IC6  2.41,27.56 180 top
J1  2.36,38.07 270 top
J2  2.54,2.54 90 top
NRST  9.12,8.36 0 top
PL3C  50.93,13.28 0 top
R1  2.54,44.45 180 top
R2  2.07,11.18 270 top
R3  5.75,2.92 90 top
R4  66.04,13.97 270 top
R5  64.62,44.5 90 top
R6  6.4,9.91 0 top
S1  6.22,49.02 0 top

### Tracks (layer width: path | path; a pad name or v marks a point on that pad's centre or on a via)
3.3V  (via drill 0.3, 0.38, 0.51)
  Top 0.203: 36.7,33.34 C5.1 | C7.1 41.82,35.53 | C21.1 35.78,15.35 | C24.1 51.1,20.61 50.85,20.61
  Top 0.279: 36.7,33.34 IC1.55 38.7,31.34 v39.47,31.34 | 41.82,35.53 42.55,34.8 42.55,34.14 IC1.50 41.15,32.74 41.15,32.13 v41.91,31.37 42.6,31.37 IC1.46 44.78,33.55 44.78,34.04 C19.1 | C6.1 29.7,26.39 30.93,26.39 IC1.73 31.63,25.64 32.22,25.05 32.22,24.79 31.63,24.19 31.63,23.73 31.61,23.71 | IC1.100 38.86,13.49 38.86,10.96 | 35.78,15.35 IC1.93 | 50.85,20.61 IC1.23 48.83,22.63 v48.26,22.63 | C25.1 51.24,24.1 IC1.26 52.94,27.56 v55.42,27.56 | C26.1 56.39,24.18 IC2.8 56.39,26.72 55.55,27.56 v55.42,27.56 | IC3.8 25.9,40.89 C27.1 | C28.1 12.24,31.6 12.49,31.84 IC5.31 12.49,34.45 v11.61,35.33 | IC5.42 17.99,34.25 18.41,34.67 22.23,34.67 C29.1 21.49,33.6 21.49,30.5 v21.89,30.1 | C14.1 5.43,17.83 IC4.100 | IC4.28 20.2,4.48 C15.1 | C16.1 27.43,13.5 26.73,13.5 IC4.50 | IC4.21 12.29,5.37 C18.1 | C21.1 35.64,14.94 34.1,14.94 33.52,14.35 33.52,12.33 v35.37,10.48 | IC4.75 17.34,25.35 C17.1 | IC1.80 32.98,21.74 32.98,22.35 31.61,23.71 | 31.61,23.71 31.59,23.74 30.5,23.74 30.07,23.3 C20.1 | v9.5,38.61 IC5.24 | IC1.5 44.76,13.97 C23.1 45.51,13.59 46.39,12.7 v48.26,12.7 | IC2.6 55.39,27.53 v55.42,27.56 | v22.4,42.37 21.45,42.37 20.99,41.91 IC5.1
  Top 0.406: C19.1 C3.1 v46.77,37.58 v46.76,37.59 | C7.1 42.57,36.31 v42.57,38.63 | C11.1 C16.1 | J2.1 3.94,2.54 4.41,2.07 R3.1 8.65,2.07 C13.1 | C17.1 C12.1 | v28.31,30.3 28.33,30.27 28.33,29.05 29.53,27.86 29.53,27.31 C6.1
  Top 0.457: v20.62,1.63 21.11,2.11 21.11,3.25 C15.1
  Top 0.533: 38.86,10.96 C22.1 | C18.1 C13.1 11.26,3.51 11.26,2.99 v10.57,2.3 | v36.24,11.44 38.38,11.44 C22.1 | C22.1 39.44,10.39 v42.44,10.39 | v4.29,25.2 4.29,25.55 3.59,26.26 IC6.5 3.36,25 C2.1 4.23,21.17 4.7,20.7 C14.1 4.7,16.89 v1.78,13.97 | v55.42,27.56 58.29,30.43 B1.VCC | v25.86,33.68 25.86,40.44 C27.1 25.65,41.76 25.04,42.37 v22.4,42.37 | C17.1 17.36,26.21 18.7,26.21 19.73,27.25 v19.73,28.07 v19.74,28.07 | v32.4,9.9 28.86,9.9 27.43,11.33 27.43,12.59 C16.1
  Bottom 0.279: 41.88,31.34 v41.91,31.37
  Bottom 0.406: v46.76,37.59 45.72,38.63 v42.57,38.63 | v39.47,31.34 41.88,31.34
  Bottom 0.457: v20.62,1.63 19.52,0.52 12.7,0.52
  Bottom 0.533: v36.24,11.44 35.37,10.57 v35.37,10.48 34.79,9.9 v32.4,9.9 | v42.44,10.39 44.76,12.7 v48.26,12.7 | v4.29,25.2 4.29,26.11 11.61,33.43 v11.61,35.33 | v11.61,35.33 9.5,37.44 v9.5,38.61 | v1.78,13.97 5.08,10.67 5.08,2.39 6.3,1.17 9.44,1.17 v10.57,2.3 12.34,0.52 12.7,0.52 | v20.62,1.63 21.73,0.52 34.29,0.52 35.42,1.65 B1.3.3V 35.42,1.64 36.52,0.53 46.33,0.53 49.66,3.86 49.66,11.3 v48.26,12.7 | v48.26,12.7 49.61,14.05 49.61,21.29 v48.26,22.63 53.19,27.56 v55.42,27.56 55.42,34.75 52.58,37.59 v46.76,37.59 | v28.31,30.3 30.18,32.17 28.68,33.68 v25.86,33.68 25.48,33.68 v21.89,30.1 21.77,30.1 v19.74,28.07 | v22.4,42.37 15.37,35.33 v11.61,35.33
5V  (via drill 0.38, 0.51)
  Top 0.279: C9.1 12.49,41.94 IC5.18 12.49,39.53 v12.95,39.06 | C10.1 17.99,42.34 IC5.7 17.99,39.68 v17.37,39.06
  Top 0.406: IC6.1 3.36,30.33 | 3.36,30.33 3.36,31.05 D1.C 2.53,31.75 1.46,30.68 IC6.3 | 3.36,30.33 4.38,30.33 C1.1 5.5,26.84 C8.1 | C9.1 17.32,47.98 42.42,47.98 43.05,48.62 v43.05,48.64 | D2.C 24.01,2.54 25.36,3.89 28.99,3.89 B1.IOREF 31.69,1.19 36.61,1.19 B1.5V 39.97,4.55 46.41,4.55 47.75,3.2 47.75,1.7 48.97,0.48 54.3,0.48 55.74,1.92 B1.5V@1 | v64.62,48.59 R5.2
  Top 0.457: 15.24,0.52 12.7,0.52
  Top 0.533: D2.C 22.99,1.4 22.11,0.52 15.24,0.52 | 12.7,0.52 1.26,0.52 0.52,1.26 0.52,27.92 IC6.3 | D1.C 3.45,32.54 v3.45,33.4 | v5.59,42.55 C9.1
  Bottom 0.406: v64.62,48.59 43.1,48.59 v43.05,48.64
  Bottom 0.533: v17.37,39.06 16.94,39.5 13.39,39.5 v12.95,39.06 | v5.59,42.55 5.56,42.52 4.23,42.52 2.31,40.6 2.31,34.54 v3.45,33.4
A0  (via drill 0.3)
  Top 0.203: IC3.20 38.36,38.39 37.67,37.7 v37.67,37.67 v37.66,37.66 37.66,33.09 IC1.54 | v7.56,22.15 7.29,21.88 6.53,21.12 6.53,18.85 IC4.97
  Bottom 0.203: v7.56,22.15 12.17,22.15 16.79,26.77 16.79,29.87 26.08,39.17 36.8,39.17 37.67,38.3 v37.67,37.67
A1  (via drill 0.3)
  Top 0.203: IC1.53 38.1,33.36 38.1,37.06 v38.71,37.67 38.93,37.89 IC3.19 | IC4.98 7.5,17.28 6.15,18.63 6.15,21.66 7.29,22.8 v7.56,23.06
  Bottom 0.203: v7.56,23.06 12.55,23.06 16.41,26.93 16.41,30.03 25.95,39.58 36.95,39.58 38.71,37.82 v38.71,37.67
A2  (via drill 0.3)
  Top 0.203: IC3.18 39.43,37.39 38.9,36.86 v38.9,36.85 v38.89,36.85 38.48,36.44 38.48,33.69 IC1.52 | v8.85,16.09 8.85,16.07 IC4.1
  Bottom 0.203: v8.85,16.09 8.85,17.21 17.93,26.29 17.93,29.4 23.66,35.13 37.17,35.13 v38.9,36.85
A3  (via drill 0.3)
  Top 0.203: IC3.17 39.98,36.89 v39.13,36.04 v39.12,36.04 38.86,35.79 38.86,34.01 IC1.51 | IC4.2 8.93,15.44 v9.42,15.44
  Bottom 0.203: v9.42,15.44 | v9.42,15.44 9.46,15.48 9.46,17.29 18.31,26.14 18.31,29.24 23.82,34.75 37.82,34.75 v39.12,36.04
A4  (via drill 0.3)
  Top 0.203: IC1.75 30.42,25.49 28.49,25.49 26.52,27.46 26.52,32.28 v27.1,32.87 28.6,34.37 28.6,36.62 28.33,36.89 IC3.16 | IC4.3 9.01,14.81 v10.01,14.81
  Bottom 0.203: v10.01,14.81 10.03,14.83 10.03,17.32 25.58,32.87 v27.1,32.87
A5  (via drill 0.3)
  Top 0.203: IC1.74 30.72,25.89 28.64,25.89 26.9,27.63 26.9,31.7 v27.23,32.03 28.98,33.78 28.98,36.85 28.44,37.39 IC3.15 | IC4.4 9.08,14.17 v10.64,14.17
  Bottom 0.203: v10.64,14.17 10.63,14.19 10.63,17.38 25.28,32.03 v27.23,32.03
A6  (via drill 0.3)
  Top 0.203: IC3.14 28.61,37.89 29.39,37.11 29.39,33.3 v28.07,31.98 29.59,30.45 29.59,29.14 IC1.71 | v11.25,13.54 v11.24,13.53 9.14,13.53 IC4.5
  Bottom 0.203: v11.25,13.54 11.27,13.55 11.27,17.47 25.21,31.42 27.51,31.42 v28.07,31.98
A7  (via drill 0.3)
  Top 0.203: IC3.13 28.65,38.39 29.97,37.07 29.97,29.47 IC1.70 33.48,25.96 33.48,25.27 34.06,24.69 35.27,24.69 35.67,25.1 v35.67,25.12 | IC4.38 21.37,10.38 21.37,11.47 21.83,11.93 21.83,13.68 v21.48,14.03
  Bottom 0.203: v21.48,14.03 21.46,14.05 21.46,15.65 22.06,16.25 24.11,16.25 25.66,17.8 31.98,17.8 37.51,23.33 37.51,24.18 36.56,25.12 v35.67,25.12
A8  (via drill 0.3)
  Top 0.203: IC3.3 29.12,43.39 32.64,39.87 32.64,31.75 IC1.63 35.78,28.61 36.56,28.61 37.31,27.86 39.78,27.86 v41.12,29.21 | IC4.39 24.74,7.72 27.79,7.72 v29.15,9.08
  Bottom 0.203: v29.15,9.08 29.15,10.73 30.14,11.72 33.01,11.72 42.93,21.64 42.93,25.96 41.12,27.76 v41.12,29.21
A9  (via drill 0.3)
  Top 0.203: IC3.2 29.16,43.89 33.02,40.02 33.02,32.08 IC1.62 36.08,29.02 36.72,29.02 37.49,28.25 39.27,28.25 v40.23,29.21 | IC4.40 25.01,8.15 27.36,8.15 v28.31,9.1
  Bottom 0.203: v28.31,9.1 28.41,9.21 28.41,10.55 29.98,12.13 32.85,12.13 42.55,21.82 42.55,25.78 40.23,28.09 v40.23,29.21
A10  (via drill 0.3)
  Top 0.203: IC3.31 42.84,43.89 50.16,36.56 50.16,35.13 46.66,31.62 45.69,31.62 IC1.42 43.85,29.79 v43.85,27.78 | IC4.41 24.78,9.09 v24.94,9.09
  Bottom 0.203: v24.94,9.09 24.94,10.16 28.83,14.05 32,14.05 40.18,22.22 40.18,25.3 37.45,28.04 37.45,29.32 37.98,29.85 41.37,29.85 43.44,27.78 v43.85,27.78
A11  (via drill 0.3)
  Top 0.203: IC3.1 29.19,44.39 33.4,40.18 33.4,33.11 IC1.60 37.88,28.63 38.76,28.63 v39.34,29.21 | IC4.42 24.87,9.71 25.2,9.71 25.79,9.12 v25.79,9.09
  Bottom 0.203: v25.79,9.09 25.79,9.02 25.95,8.87 27.2,8.87 27.58,9.25 27.58,9.27 28.01,9.69 28.01,10.71 29.82,12.52 32.63,12.52 42.16,22.05 42.16,25.6 39.34,28.42 v39.34,29.21
A12  (via drill 0.3)
  Top 0.203: IC3.12 28.71,38.89 30.35,37.25 30.35,29.79 IC1.69 34.08,26.07 v34.17,26.07 | IC4.43 22.21,13.07 22.21,14.26 20.9,15.58 v20.85,15.58
  Bottom 0.203: v20.85,15.58 21.9,16.63 23.95,16.63 25.51,18.19 31.82,18.19 37.13,23.49 37.13,24 36.81,24.32 35.61,24.32 34.17,25.77 v34.17,26.07
A13  (via drill 0.3)
  Top 0.203: IC3.4 29.08,42.89 32.26,39.71 32.26,31.42 IC1.64 34.89,28.87 35.55,28.21 36.39,28.21 37.11,27.48 39.42,27.48 v39.65,27.25 | IC4.44 25.85,10.14 v25.85,9.93
  Bottom 0.203: v39.65,27.25 41.78,25.12 41.78,22.21 32.48,12.9 29.66,12.9 27.63,10.87 27.63,9.85 27.02,9.25 26.57,9.25 25.88,9.93 v25.85,9.93
A14  (via drill 0.3)
  Top 0.203: IC3.5 29.04,42.39 31.88,39.55 31.88,31.1 IC1.65 38.11,24.87 v41.17,24.87 | IC4.45 26.8,9.9 v26.8,9.88
  Bottom 0.203: v41.17,24.87 41.17,22.14 32.32,13.28 29.5,13.28 27.23,11.02 27.23,10.31 v26.8,9.88
A15  (via drill 0.3)
  Top 0.203: IC3.11 28.75,39.39 30.73,37.41 30.73,30.12 IC1.68 34.14,26.72 34.42,26.72 35.09,26.04 v35.09,25.73 | IC4.46 24.25,13.16 23.03,13.16 22.61,13.58 22.61,15.01 v22.3,15.32
  Bottom 0.178: 36.24,26.01 36.21,26.01
  Bottom 0.203: v22.3,15.32 22.76,15.32 23.29,15.85 24.25,15.85 25.82,17.42 32.14,17.42 37.89,23.18 37.89,24.35 36.24,26.01 | 36.21,26.01 35.37,26.01 v35.09,25.73
A16  (via drill 0.3)
  Top 0.203: IC3.10 28.79,39.89 31.11,37.57 31.11,30.45 IC1.67 34.36,27.2 34.48,27.2 36.28,25.4 36.28,24.86 35.7,24.29 32.96,24.29 32.96,24.27 v32.48,23.79 | IC4.65 20.6,20.74 20.6,20.33 v23.1,17.83
  Bottom 0.203: v23.1,17.83 24.22,18.95 31.47,18.95 32.48,19.95 v32.48,23.79
A17  (via drill 0.3)
  Top 0.203: IC3.6 29,41.89 31.5,39.39 31.5,30.77 IC1.66 36.66,25.6 36.66,24.68 35.84,23.85 33.8,23.85 v33.1,23.16 | IC4.66 19.96,20.82 19.96,20.09 22.86,17.2 23.65,17.2 v23.7,17.24
  Bottom 0.178: v33.1,23.16 33.01,23.06
  Bottom 0.203: v23.7,17.24 25.02,18.57 31.64,18.57 33.01,19.93 33.01,23.06
AIEN  (via drill 0.3)
  Top 0.203: IC4.34 19.67,9.25 19.67,10.42 19.35,10.74 v19.35,11.42
  Bottom 0.203: v19.35,11.42 19.07,11.7 5.54,11.7 0.51,16.73 0.51,51.21 2.08,52.78 21.75,52.78 B1.AREF
AIN0  (via drill 0.3, 0.38)
  Top 0.203: B1.AIN 48.17,5.03 34.92,5.03 34.04,4.14 v34.04,4.12 | IC4.15 7.87,5.19 7.87,4.42 v8.69,3.61
  Bottom 0.203: v34.04,4.12 33.55,4.6 9.68,4.6 v8.69,3.61
BF_CLK  (via drill 0.3)
  Top 0.203: IC4.67 17.91,19.46 17.91,17.42 13.52,13.03 v13.52,11.09 | IC1.8 43.25,17.6 v41.3,17.6
  Bottom 0.203: v13.52,11.09 13.52,6 14.15,5.36 44.07,5.36 48.25,9.54 48.25,10.53 47.87,10.91 44.9,10.91 43.2,9.22 42.09,9.22 41.3,10.01 v41.3,17.6
BF_RST  (via drill 0.3)
  Top 0.203: IC4.80 17.53,19.88 17.53,17.58 12.85,12.9 v12.85,10.57 | IC1.7 43.15,16.99 v42.14,16.99
  Bottom 0.203: v12.85,10.57 12.85,6.12 13.99,4.98 44.23,4.98 48.63,9.38 48.63,10.69 48.02,11.29 44.74,11.29 43.05,9.6 42.31,9.6 41.68,10.23 41.68,16.54 v42.14,16.99
BOOT0
  Top 0.203: IC4.94 9.47,18.03 9.47,17.6 2.2,10.33 R2.2 3.81,8.59 3.81,6.35 J2.2
BRD_RST  (via drill 0.3, 0.38)
  Top 0.203: C4.1 10.28,46.77 S1.A2 7.88,44.45 v6.35,44.45 | B1.RESET@1 31.05,4.37 21.56,4.37 20.87,5.05 20.87,7.34 IC4.33 19.29,8.92 19.29,10.26 18.7,10.85 18.7,12.04 18.95,12.29 v19.36,12.29
  Bottom 0.203: v6.35,44.45 4.39,44.45 0.89,40.95 0.89,16.89 5.7,12.08 19.14,12.08 v19.36,12.29
D0  (via drill 0.3)
  Top 0.203: IC1.57 36.53,32.1 36.07,32.1 34.54,33.63 34.54,35.46 v35.89,36.8 37.98,38.89 IC3.21 | IC4.95 7.56,19.24 v7.56,20.32
  Bottom 0.203: v7.56,20.32 11.42,20.32 17.55,26.45 17.55,29.56 23.5,35.51 34.59,35.51 v35.89,36.8
D1  (via drill 0.3)
  Top 0.203: IC1.58 36.23,31.7 35.92,31.7 34.16,33.46 34.16,36.22 36.5,38.56 v36.54,38.56 36.54,38.6 37.33,39.39 IC3.22 | v7.56,21.23 7.29,20.97 6.91,20.59 6.91,19.18 IC4.96
  Bottom 0.203: v7.56,21.23 11.79,21.23 17.17,26.61 17.17,29.72 26.22,38.76 36.37,38.76 36.54,38.59 v36.54,38.56
D2  (via drill 0.3)
  Top 0.203: IC3.23 36.99,39.89 33.78,36.68 33.78,33.28 35.77,31.3 35.92,31.3 IC1.59 37.98,29.23 v38.45,29.23 | IC4.47 26.62,11.49 v26.62,10.95
  Bottom 0.203: v26.62,10.95 29.34,13.66 32.16,13.66 40.56,22.06 40.56,25.48 38.45,27.58 v38.45,29.23
D3  (via drill 0.3)
  Top 0.203: IC1.49 43.33,34.22 v43.33,35.97 43.33,40.49 42.93,40.89 IC3.25 | IC4.48 24.21,14.62 v24.21,15.21
  Bottom 0.203: v24.21,15.21 26.04,17.04 32.3,17.04 38.27,23.02 38.27,24.51 35.1,27.68 35.1,30.3 40.77,35.97 v43.33,35.97
D4  (via drill 0.3)
  Top 0.203: IC3.26 43.02,41.39 44.04,40.37 v44.04,36.42 44.04,35.66 43.71,35.33 43.71,33.89 IC1.48 | IC4.51 26.87,15.82 v26.87,15.77
  Bottom 0.203: v26.87,15.77 27.76,16.66 32.46,16.66 38.65,22.86 38.65,24.67 36.22,27.1 36.22,27.11 35.48,27.84 35.48,30.14 40.7,35.36 43.59,35.36 43.66,35.43 44.04,35.81 v44.04,36.42
D5  (via drill 0.3)
  Top 0.203: IC3.27 43.11,41.89 44.78,40.22 v44.78,36.85 44.78,35.71 44.09,35.03 44.09,33.57 IC1.47 | v27.91,15.54 27.91,16.26 26.79,17.38 26.43,17.38 IC4.52
  Bottom 0.203: v27.91,15.54 28.65,16.28 32.61,16.28 39.03,22.7 39.03,24.82 36.6,27.26 36.6,27.27 35.87,28 35.87,29.99 40.85,34.98 43.74,34.98 44.78,36.01 v44.78,36.85
D6  (via drill 0.3)
  Top 0.203: IC3.28 43.22,42.39 48.39,37.22 48.39,36.45 IC1.45 v42.55,30.61 | v28.76,15.42 28.76,15.95 26.93,17.78 26.12,17.78 IC4.53
  Bottom 0.203: v28.76,15.42 29.24,15.9 32.77,15.9 39.42,22.55 39.42,24.99 36.28,28.13 36.28,29.86 37.03,30.61 v42.54,30.61 v42.55,30.61
D7  (via drill 0.3)
  Top 0.203: IC3.29 43.3,42.89 49.78,36.4 49.78,35.29 46.5,32 45.36,32 IC1.43 43.23,29.88 v43.23,28.88 | v29.62,15.29 29.62,15.65 27.1,18.16 25.8,18.16 IC4.54
  Bottom 0.203: v29.62,15.29 29.84,15.52 32.93,15.52 39.8,22.39 39.8,25.15 36.66,28.28 36.66,29.7 37.18,30.23 41.53,30.23 42.88,28.88 v43.23,28.88
GND  (via drill 0.3, 0.38)
  Top 0.279: v39.83,13.31 39.83,12.4 C22.2 | IC1.92 37.54,17.82 38.94,17.82 v40.28,16.47
  Top 0.533: C24.2 52.3,20.11 v52.3,19.34 | C25.2 52.14,22.49 v51.37,22.49
  other vias: 56.29,21.18 34.65,12.45 45.01,15.05 27.56,29.42 25.86,28.65 16.41,38.33 21.23,45.57 18.97,28.83 17.96,20.45 16.56,18.52 22.2,31.57 27.38,36.17 24.97,44.04 40.94,7.8 31.17,14.83 27.18,14.55 7.39,25.04 16.81,13.49 15.24,9.42 7.39,8.79 11.48,7.37 36.86,36.75 48.9,35.76 36.35,41.73 13.97,46.99 16.89,1.96 32.13,8.64 47.75,7.37 26.97,21.89 29.59,40.26 45.8,36.91 21.79,3.71 24.16,1.37 37.97,9.83 26.24,1.91 52.12,25.17 36.5,4.11
  pour Top: 1.27,0 0,1.27 0,53.34 64.52,53.34 66.04,51.82 66.04,40.39 68.58,37.85 68.58,30.48 68.58,7.62 68.58,5.08 66.04,2.54 66.04,0
  pour Bottom: 66.04,0 0,0 0,53.34 64.52,53.34 66.04,51.82 66.04,40.26 68.58,37.72 68.58,35.56 68.58,5.08 66.04,2.54
IN0  (via drill 0.3)
  Top 0.203: IC4.81 12.78,23.92 12.78,25.93 v14.91,28.06 v14.91,28.07
  Bottom 0.203: B1.IN0 36.94,46.23 30.99,46.23 14.91,30.15 v14.91,28.07
IN0_BFUP  (via drill 0.3)
  Top 0.203: v47.64,10.27 47.64,10.38 IC1.4 | v15.3,7.59 15.3,6.96 IC4.23
  Bottom 0.203: v47.64,10.27 47.64,9.46 43.98,5.8 17.09,5.8 v15.3,7.59
IN1  (via drill 0.3)
  Top 0.203: IC4.82 12.4,23.59 12.4,26.09 14.2,27.89 v14.2,28.68
  Bottom 0.203: v14.2,28.68 14.2,30.02 30.79,46.61 34.78,46.61 B1.IN1
IN1_BFUP  (via drill 0.3)
  Top 0.203: v46.8,10.3 46.79,10.31 46.79,10.53 IC1.3 | v15.3,8.47 16.09,7.68 16.09,7.04 IC4.24
  Bottom 0.203: v46.8,10.3 46.8,9.16 43.82,6.18 17.59,6.18 v15.3,8.47
IN2  (via drill 0.3)
  Top 0.203: IC4.83 12.02,23.27 12.02,26.45 13.5,27.93 v13.5,28.07
  Bottom 0.203: v13.5,28.07 13.5,29.85 30.63,46.99 32.63,46.99 B1.IN2
IN2_BFUP  (via drill 0.3)
  Top 0.203: IC1.2 45.95,10.66 45.95,10.29 v45.96,10.27 | v16.19,8.47 16.55,8.11 16.55,6.79 IC4.25
  Bottom 0.203: v45.96,10.27 45.96,8.87 43.66,6.57 18.09,6.57 v16.19,8.47
IN3  (via drill 0.3)
  Top 0.203: IC4.84 11.64,22.94 11.64,26.61 12.83,27.8 v12.83,28.68
  Bottom 0.203: v12.83,28.68 12.83,29.72 B1.IN3
IN3_BFUP  (via drill 0.3)
  Top 0.203: IC1.1 45.12,10.78 v45.12,10.27 | v16.19,9.33 16.98,8.54 16.98,6.28 IC4.26 | v45.12,10.27
  Bottom 0.203: v45.12,10.27 45.12,8.57 43.51,6.95 18.57,6.95 v16.19,9.33
IN4  (via drill 0.3)
  Top 0.203: IC4.85 11.26,22.61 11.26,26.92 12.22,27.88 v12.22,28.07
  Bottom 0.203: v12.22,28.07 12.22,29.65 31.36,48.79 B1.IN4
IN4_BFUP  (via drill 0.3)
  Top 0.203: IC1.99 38.27,13.6 38.27,12.57 v37.99,12.29 | v17.07,9.33 17.42,8.98 17.42,7.96 IC4.29
  Bottom 0.203: v17.07,9.33 19.07,7.33 33.9,7.33 37.99,11.41 v37.99,12.29
IN5  (via drill 0.3)
  Top 0.203: IC4.86 10.88,22.29 10.88,27.08 11.57,27.78 v11.57,28.67 v11.58,28.68
  Bottom 0.203: v11.58,28.68 11.58,29.55 28.82,46.79 B1.IN5
IN5_BFUP  (via drill 0.3)
  Top 0.203: IC4.30 17.88,8.21 17.88,9.4 v17.08,10.2 v17.07,10.2 | v36.96,12.36 37.88,13.28 37.88,13.92 IC1.98
  Bottom 0.203: v17.07,10.2 19.56,7.71 33.74,7.71 36.96,10.92 v36.96,12.36
IN6  (via drill 0.3)
  Top 0.203: IC4.87 10.49,21.96 10.49,27.59 v10.96,28.06 v10.96,28.07
  Bottom 0.203: v10.96,28.07 10.96,29.48 24.27,42.78 24.27,47.73 B1.IN6
IN6_BFUP  (via drill 0.3)
  Top 0.203: IC1.97 37.38,14.12 37.38,13.75 v36.92,13.3 | v17.95,10.2 18.29,9.85 18.29,8.51 IC4.31
  Bottom 0.203: v17.95,10.2 20.05,8.09 29.58,8.09 30.15,8.66 30.15,10.64 30.46,10.95 34.67,10.95 36.92,13.2 v36.92,13.3
IN7  (via drill 0.3)
  Top 0.203: IC4.88 10.11,21.64 10.11,27.98 10.36,28.22 v10.36,28.68
  Bottom 0.203: v10.36,28.68 10.36,29.41 23.89,42.94 23.89,45.57 B1.IN7
IN7_BFUP  (via drill 0.3)
  Top 0.203: v35.93,13.2 35.93,13.38 IC1.96 | IC4.32 18.91,8.6 18.91,10.1 v17.95,11.07
  Bottom 0.203: v17.95,11.07 20.54,8.47 29.4,8.47 29.76,8.83 29.76,10.78 30.3,11.33 34.47,11.33 35.93,12.79 v35.93,13.2
INCMG
  Top 0.203: B1.INCOMING 58.28,4.03 56.9,5.41 37.8,5.41 31.88,11.34 31.88,17.45 31.37,17.96 27.87,17.96 24.25,21.58 22.85,21.58 IC4.63
INCMG_BFUP  (via drill 0.3)
  Top 0.203: IC1.76 30.57,22.16 29.96,22.16 28.29,23.83 v27.77,23.83 | IC4.64 v22.93,22.37 v22.94,22.37
  Bottom 0.203: v22.94,22.37 23.27,22.37 24.73,23.83 v27.77,23.83
INSTR_BFUP  (via drill 0.3)
  Top 0.203: IC1.77 30.7,21.59 29.99,21.59 28.36,23.21 v27.17,23.21 | v15.09,13.54 15.09,11.7 IC4.16
  Bottom 0.203: v15.09,13.54 15.77,13.54 25.47,23.24 27.14,23.24 v27.17,23.21
INSTR_LVL  (via drill 0.3)
  Top 0.203: IC4.17 15.78,11.68 v15.78,12.69 | IC5.35 14.48,33.07 v14.48,34.54
  Bottom 0.203: v15.78,12.69 15.54,12.93 11,12.93 6.55,17.38 6.55,26.59 14.48,34.52 v14.48,34.54
INSTRB
  Top 0.203: B1.INST 60.82,3.87 58.9,5.79 37.96,5.79 32.26,11.49 32.26,17.61 31.53,18.34 28.02,18.34 25.6,20.76 25.6,26.39 24.79,27.2 24.79,36.09 23.59,37.29 15.41,37.29 14.49,38.21 IC5.14
N$1
  Top 0.203: IC2.18 59.89,35.93 IC1.28
N$2
  Top 0.203: IC1.29 59.39,36.14 IC2.19
N$3
  Top 0.203: IC2.20 58.89,36.34 IC1.30
N$4
  Top 0.203: IC2.21 58.39,36.55 IC1.31
N$5
  Top 0.203: IC1.32 57.89,36.76 IC2.22
N$6
  Top 0.203: IC1.34 57.39,37.67 IC2.23
N$7
  Top 0.203: IC1.35 56.39,37.38 IC2.25
N$8
  Top 0.203: IC1.41 46.01,31.24 46.82,31.24 52.89,37.32 IC2.32
N$9
  Top 0.203: IC1.27 60.39,35.72 IC2.17
N$10
  Top 0.203: IC1.36 55.89,37.59 IC2.26
N$11
  Top 0.203: IC1.37 47.32,29.72 47.45,29.72 55.39,37.66 IC2.27
N$12
  Top 0.203: IC1.38 46.99,30.1 47.29,30.1 54.89,37.7 IC2.28
N$13
  Top 0.203: IC1.39 46.66,30.48 47.13,30.48 54.39,37.74 IC2.29
N$14
  Top 0.203: IC1.40 46.34,30.86 46.98,30.86 53.39,37.28 IC2.31
N$15
  Top 0.203: PL3C.1 50.93,13.64 50.06,14.51 48.7,14.51 47.38,15.82 45.74,15.82 IC1.9
N$16
  Top 0.406: R5.1 64.62,40.8 D3.A
N$17
  Top 0.279: IC6.4 1.46,24.41 C30.1
N$18
  Top 0.533: D2.A 25.28,1.35 26.11,0.52 44.07,0.52 45.58,2.03 B1.VIN
N$19  (via drill 0.51)
  Top 0.406: J1.1 5.72,39.41 5.84,39.52 v5.84,40.26
  Top 0.533: v5.84,32.77 5.84,32.63 D1.A
  Bottom 0.533: v5.84,40.26 v5.84,32.77
N$20
  Top 0.203: R6.2 9.76,9.91 IC4.11
N$21  (via drill 0.3)
  Top 0.203: R6.1 5.55,12.81 v5.74,13.01 | D4.A v7.62,31.75
  Bottom 0.203: v5.74,13.01 5.74,21.64 3.05,24.33 3.05,27.81 6.99,31.75 v7.62,31.75
N$23
  Top 0.203: R3.2 5.75,5 6.68,5.92 6.73,5.92 9.12,8.31 NRST.1 10.33,8.36 IC4.14
N$34
  Top 0.203: IC5.2 20.49,42 23.32,44.83 61.72,44.83 63.36,46.47 B1.OUT0
N$35
  Top 0.203: IC1.25 51.03,21.84 52.67,21.84 53.57,22.74 53.57,24.14 52.89,24.82 IC2.1
N$36
  Top 0.203: IC1.24 50.1,22.17 50.8,21.46 52.83,21.46 53.95,22.59 53.95,24.3 53.39,24.86 IC2.2
N$37
  Top 0.203: IC2.3 53.89,24.89 54.33,24.46 54.33,20.46 52.57,18.7 50.53,18.7 49.78,19.44 49.78,20.26 IC1.21
N$40
  Top 0.203: IC1.18 48.62,19.31 48.62,18.99 50.05,17.55 53.04,17.55 55.51,20.02 55.51,24.8 55.89,25.18 IC2.7
N$43
  Top 0.203: IC1.15 47.99,17.82 48.14,17.82 49.55,16.41 53.52,16.41 58.39,21.29 IC2.12
N$44
  Top 0.203: IC1.14 47.68,17.41 47.99,17.41 49.37,16.03 53.67,16.03 58.89,21.25 IC2.13
N$45
  Top 0.203: IC1.13 47.38,17.01 47.83,17.01 49.19,15.65 53.83,15.65 59.39,21.21 IC2.14
N$46
  Top 0.203: IC1.12 47.08,16.6 47.69,16.6 49.02,15.27 53.99,15.27 59.89,21.17 IC2.15
N$47
  Top 0.203: IC1.10 46.07,16.2 47.54,16.2 48.85,14.89 54.15,14.89 60.39,21.13 IC2.16
N$49
  Top 0.203: B1.OUT1 60.82,46.72 59.31,45.21 23.16,45.21 19.99,42.04 IC5.3
N$50
  Top 0.203: B1.OUT2 58.42,50.66 58.42,46.99 57.02,45.59 22.99,45.59 18.99,41.6 IC5.5
N$51
  Top 0.203: IC5.6 18.49,41.63 22.83,45.97 54.74,45.97 55.74,46.98 B1.OUT3
N$52
  Top 0.203: IC5.8 17.49,42.94 20.91,46.35 51.82,46.35 53.2,47.74 B1.OUT4
N$53
  Top 0.203: B1.OUT5 50.66,47.99 49.4,46.74 20.75,46.74 16.99,42.98 IC5.9
N$54
  Top 0.203: IC1.17 48.21,19.01 48.21,18.85 49.89,17.17 53.2,17.17 57.39,21.37 IC2.10
N$55
  Top 0.203: B1.OUT6 48.12,48.25 46.99,47.12 18.41,47.12 15.99,44.7 IC5.11
N$56
  Top 0.203: IC5.12 15.49,44.74 18.25,47.5 45.09,47.5 45.59,48.01 45.59,50.79 B1.OUT7
N$58
  Top 0.203: IC1.20 49.4,19.94 49.4,19.28 50.37,18.32 52.73,18.32 54.71,20.3 54.71,24.62 54.39,24.93 IC2.4
N$59
  Top 0.203: IC1.19 49.02,19.61 49.02,19.13 50.21,17.93 52.88,17.93 55.09,20.14 55.09,24.77 54.89,24.97 IC2.5
N$61
  Top 0.203: IC1.16 49.72,16.79 53.36,16.79 57.89,21.33 IC2.11
N$93
  Top 0.203: J1.4 3.64,37.45 3.19,37.91 3.19,44.25 R1.1
OE  (via drill 0.3)
  Top 0.203: IC3.32 31.41,44.39 v31.16,44.13 | v14.75,26.13 13.99,25.38 13.99,24.83 IC4.78
  Bottom 0.203: v31.16,44.13 29.39,42.37 29.39,40.99 29.03,40.63 26.47,40.63 16.03,30.19 16.03,27.41 v14.75,26.13
OUT0  (via drill 0.3)
  Top 0.203: IC1.81 31.88,19.94 29.3,19.94 28.41,20.83 v27.07,20.83 | v20.22,12.29 20.22,9.41 IC4.35 | IC5.47 20.49,30.02 23.22,27.29 23.22,24.37 v23.38,24.21
  Bottom 0.203: v20.22,12.29 20.22,12.32 18.85,13.69 18.85,15.52 24.16,20.83 v27.07,20.83 30.9,20.83 31.29,21.22 31.29,22.56 28.95,24.9 23.89,24.9 23.38,24.39 v23.38,24.21
OUT1  (via drill 0.3)
  Top 0.203: IC1.82 32.2,19.55 29.13,19.55 28.47,20.21 v27.64,20.21 | v20.24,13.18 20.24,13.13 20.83,12.55 20.83,12.02 20.6,11.79 20.6,9.73 IC4.36 | IC5.46 19.99,29.97 22.53,27.43 v22.53,24.21
  Bottom 0.203: v20.24,13.18 19.25,14.17 19.25,15.38 24.08,20.21 v27.64,20.21 31.29,20.21 31.69,20.6 31.69,22.7 29.11,25.28 23.56,25.28 22.53,24.25 v22.53,24.21
OUT2  (via drill 0.3)
  Top 0.203: IC1.83 32.52,19.16 28.64,19.16 v28.23,19.57 | v21.2,13.16 21.21,13.15 21.21,11.86 20.98,11.63 20.98,10.06 IC4.37 | IC5.44 18.99,30.43 21.68,27.74 v21.68,24.21
  Bottom 0.203: v21.68,24.21 21.68,24.25 23.09,25.66 29.26,25.66 32.08,22.84 32.08,20.12 31.53,19.57 v28.23,19.57 28.21,19.59 24,19.59 19.63,15.22 19.63,14.73 v21.2,13.16
OUT3  (via drill 0.3)
  Top 0.203: IC5.43 18.49,32.21 15.57,29.29 10.03,29.29 9.73,28.99 9.73,21.31 IC4.89 12.76,18.29 v15.21,18.29 | v33.63,21.74 34.57,20.8 34.57,20.51 IC1.84
  Bottom 0.203: v15.21,18.29 15.21,18.64 22.63,26.06 31.09,26.06 33.72,23.43 33.72,21.83 v33.63,21.74
OUT4  (via drill 0.3)
  Top 0.203: IC5.41 17.49,31.75 15.41,29.67 9.87,29.67 9.35,29.15 9.35,20.98 IC4.90 12.71,17.63 v14.56,17.63 | IC1.85 34.98,20.2 34.98,21.28 v34.52,21.74
  Bottom 0.203: v34.52,21.74 34.11,22.15 34.11,23.59 31.25,26.45 22.46,26.45 14.56,18.55 v14.56,17.63
OUT5  (via drill 0.3)
  Top 0.203: IC5.40 16.99,31.79 15.25,30.05 9.71,30.05 8.97,29.31 8.97,20.66 IC4.91 12.66,16.97 v13.89,16.97 | IC1.86 35.37,19.89 35.37,21.75 34.74,22.38 v34.74,23.19
  Bottom 0.203: v34.74,23.19 34.74,23.52 31.4,26.86 22.33,26.86 13.89,18.42 v13.89,16.97
OUT6  (via drill 0.3)
  Top 0.203: IC5.38 15.99,31.33 15.09,30.43 9.53,30.43 8.59,29.49 8.59,20.33 IC4.92 12.62,16.31 v13.23,16.31 | v35.39,22.61 35.75,22.26 35.75,19.56 IC1.87
  Bottom 0.203: v35.39,22.61 35.39,23.43 31.56,27.26 22.2,27.26 13.23,18.3 v13.23,16.31
OUT7  (via drill 0.3)
  Top 0.203: IC5.37 15.49,31.36 14.94,30.81 9.37,30.81 8.21,29.65 8.21,20 IC4.93 v12.57,15.65 | IC1.88 36.14,19.25 36.14,23.11 v36.01,23.24
  Bottom 0.203: v36.01,23.24 36.01,23.36 31.72,27.66 22.04,27.66 12.58,18.2 v12.58,15.65 v12.57,15.65
OUTSTR_BFUP  (via drill 0.3)
  Top 0.203: IC1.78 31.01,21.19 29.84,21.19 28.44,22.59 v28.11,22.59 | v18.24,14.2 18.24,13.43 IC4.18 | IC5.36 14.99,34.04 17.09,36.14 22.89,36.14 23.65,35.38 23.65,26.72 24.23,26.14 v24.23,24.21
  Bottom 0.203: v18.24,14.2 18.21,14.17 18.21,15.43 25.37,22.59 v28.11,22.59 28.65,23.12 28.65,23.82 27.96,24.52 24.54,24.52 v24.23,24.21
OUTSTRB
  Top 0.203: IC5.13 14.99,38.26 15.58,37.67 23.75,37.67 25.17,36.25 25.17,27.36 25.98,26.55 25.98,20.92 28.18,18.72 31.68,18.72 32.64,17.77 32.64,11.65 38.12,6.17 61.06,6.17 63.36,3.87 B1.OUTST
TCK
  Top 0.203: B1.TCK 67.82,26.11 67.82,13.84 67.09,13.12 R4.2 55.52,13.12 50.91,8.51 36.32,8.51 33.02,11.81 33.02,14.64 33.82,15.44 34.45,15.44 IC1.91
TDI
  Top 0.203: IC1.94 37.95,16.81 39.01,16.81 40.58,15.24 40.58,13.39 44.7,9.27 50.5,9.27 64.04,22.81 B1.TDI
TDO
  Top 0.203: IC1.95 35.31,13.46 35.31,11.46 36.02,10.75 36.02,9.35 36.48,8.89 37.88,8.89 38.1,8.89 50.66,8.89 62.04,20.27 B1.TDO
TMS
  Top 0.203: B1.TMS 50.34,9.65 44.86,9.65 40.96,13.55 40.96,16.72 39.27,18.41 36.72,18.41 IC1.90
USB_DN
  Top 0.203: IC4.70 20.14,23.82 20.62,23.82 21.26,23.19 24.64,23.19 25.22,23.77 25.22,26.23 24.41,27.04 24.41,35.93 23.43,36.91 9.07,36.91 7.24,38.73 4.67,38.73 J1.2
USB_DP
  Top 0.203: IC4.71 19.84,24.23 20.78,24.23 21.41,23.59 24.49,23.59 24.84,23.95 24.84,26.07 24.03,26.89 24.03,35.77 23.28,36.52 8.81,36.52 7.23,38.1 J1.3
WE  (via drill 0.3)
  Top 0.203: IC3.7 28.63,41.39 v28.78,41.24 | v13.41,25.68 13.41,24.71 IC4.79
  Bottom 0.203: v28.78,41.24 26.54,41.24 15.52,30.22 15.52,27.81 13.41,25.7 v13.41,25.68

### Text on the board
bPlace: Made by Ignacio and Eduardo Corpeño | Ignacio
tNames: ON
bNames: BOARD MODEL / [-]+. R1 / ................................................................. / OPEN SOURCE ELECTRONICS / PROTOTYPING PLATFORM / ................................................................. / MADE IN GUATEMALA / ............................................... / github.com/kuashio/bf